# Altium schematic sheet 3_adcs_circuits.schdoc: Power Circuits
size A4; Engineer: Eng_2_ALT; SheetNumber: 3; SheetTotal: 3; Designed by: André M. P. Mattos; Version: v0.1
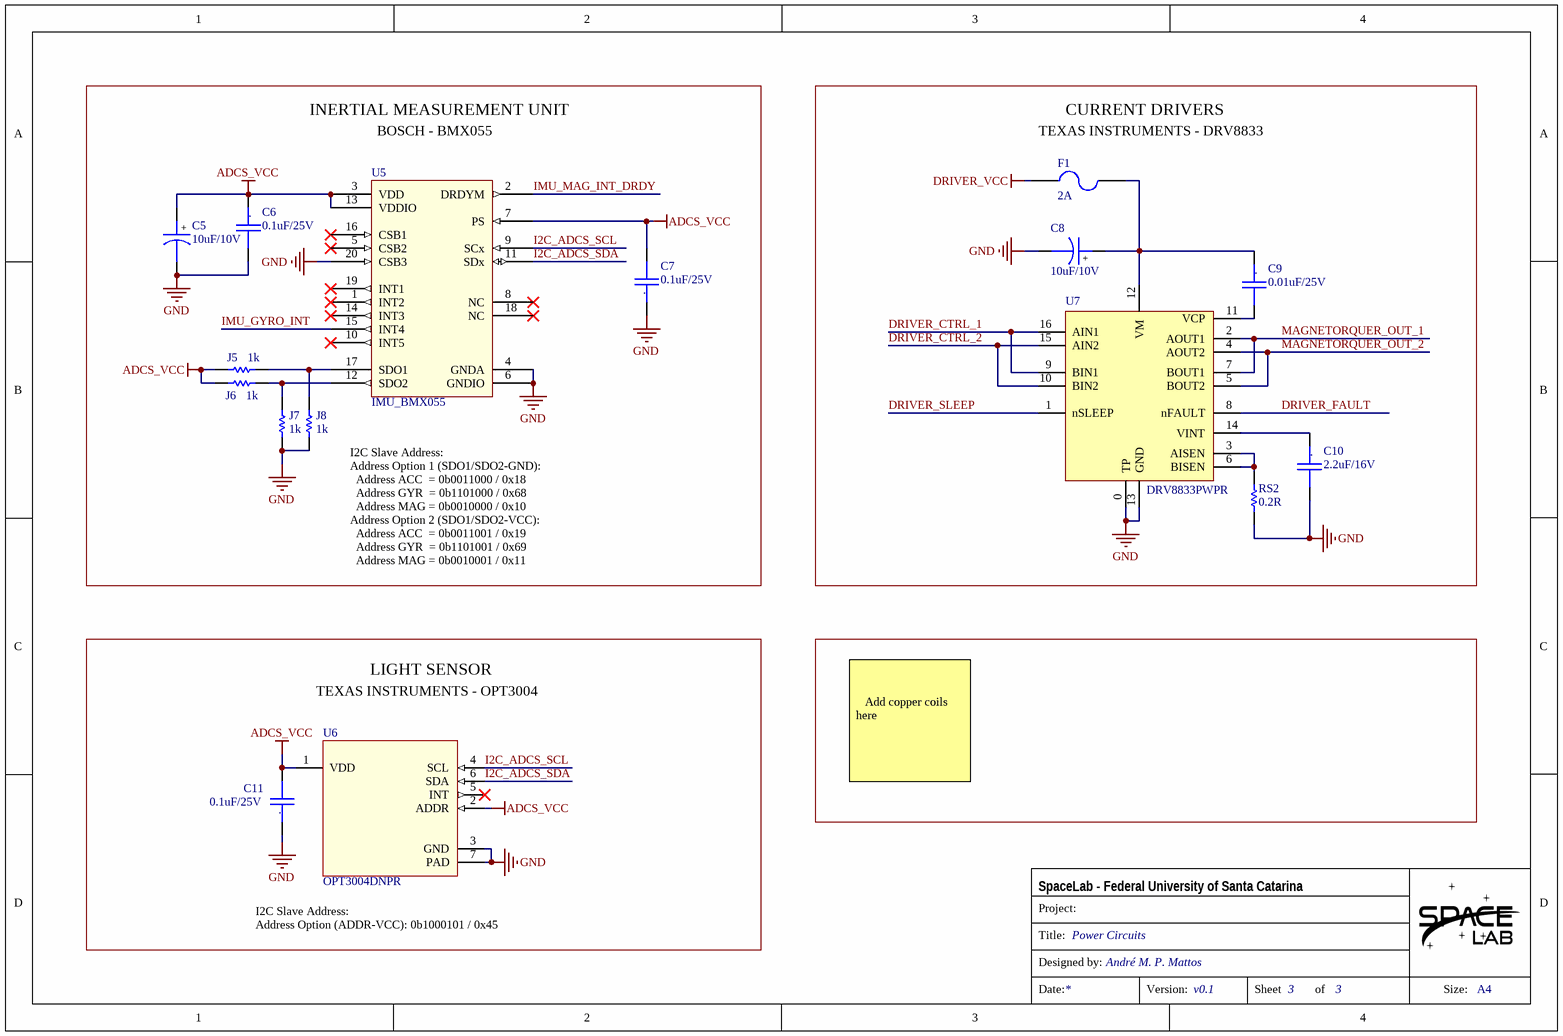
[diagram p0: 3_adcs_circuits.schdoc]

## Parts
C5  10uF/10V  [CC0805_Tantalum]
C6  0.1uF/25V  [CC0805]
C7  0.1uF/25V  [CC0805]
C8  10uF/10V  [CC0805_Tantalum]
C9  0.01uF/25V  [CC0805]
C10  2.2uF/16V  [CC0805]
C11  0.1uF/25V  [CC0805]
F1  2A  [1206]
J5  1k  [0805]
J6  1k  [0805]
J7  1k  [0805]
J8  1k  [0805]
RS2  0.2R  [0805]
U5  IMU_BMX055  [LGA20]
U6  OPT3004DNPR  [DNP0006A]
U7  DRV8833PWPR  [16TTSSOP]

## Blocks framed on the sheet
INERTIAL MEASUREMENT UNIT: C5-C7 J5-J8 U5
CURRENT DRIVERS: C8-C10 F1 RS2 U7
LIGHT SENSOR: C11 U6

## Nets
ADCS_VCC: C5.1 C6.1 C7.2 C11.2 J5.2 J6.2 U5.3(VDD) U5.7(PS) U5.13(VDDIO) U6.1(VDD) U6.2(ADDR)
DRIVER_VCC: F1.2
GND: C5.2 C6.2 C7.1 C8.2 C10.2 C11.1 J7.1 J8.1 RS2.1 U5.4(GNDA) U5.6(GNDIO) U5.20(CSB3) U6.3(GND) U6.7(PAD) U7.0(TP) U7.13(GND)
DRIVER_CTRL_1: U7.9(BIN1) U7.16(AIN1)
DRIVER_CTRL_2: U7.10(BIN2) U7.15(AIN2)
DRIVER_FAULT: U7.8(nFAULT)
DRIVER_SLEEP: U7.1(nSLEEP)
I2C_ADCS_SCL: U5.9(SCx) U6.4(SCL)
I2C_ADCS_SDA: U5.11(SDx) U6.6(SDA)
IMU_GYRO_INT: U5.15(INT4)
IMU_MAG_INT_DRDY: U5.2(DRDYM)
MAGNETORQUER_OUT_1: U7.2(AOUT1) U7.7(BOUT1)
MAGNETORQUER_OUT_2: U7.4(AOUT2) U7.5(BOUT2)
NetC8_1: C8.1 C9.1 F1.1 U7.12(VM)
NetC9_2: C9.2 U7.11(VCP)
NetC10_1: C10.1 U7.14(VINT)
NetJ5_1: J5.1 J8.2 U5.17(SDO1)
NetJ6_1: J6.1 J7.2 U5.12(SDO2)
NetRS2_2: RS2.2 U7.3(AISEN) U7.6(BISEN)

Not connected (* = marked no-connect by the designer): U5 1(INT2)* 5(CSB2)* 8(NC)* 10(INT5)* 14(INT3)* 16(CSB1)* 18(NC)* 19(INT1)*; U6 5(INT)*

## Notes on the sheet
- BOSCH - BMX055
- (near F1) TEXAS INSTRUMENTS - DRV8833
- I2C Slave Address:
  Address Option 1 (SDO1/SDO2-GND):
  Address ACC  = 0b0011000 / 0x18
  Address GYR  = 0b1101000 / 0x68
  Address MAG = 0b0010000 / 0x10
  Address Option 2 (SDO1/SDO2-VCC):
  Address ACC  = 0b0011001 / 0x19
  Address GYR  = 0b1101001 / 0x69
  Address MAG = 0b0010001 / 0x11
- TEXAS INSTRUMENTS - OPT3004
- Add copper coils here
- (near U6) I2C Slave Address:
  Address Option (ADDR-VCC): 0b1000101 / 0x45
- Project:
- SpaceLab - Federal University of Santa Catarina
- Title:
- Designed by:
- Date:
- Version:
- Sheet
- of
- Size:
- A4
- (in symbol Cap_Cer_X7R_0.1uF_25V_0805) .
- (in symbol Cap_Cer_X7R_0.01uF_50V_0805) .
- (in symbol Cap_Cer_X7R_2.2uF_16V_0805) .
- (in symbol Cap_Tant_SMD_10uF_10V_0805) +

## Library data of the parts
C5 C8 = Cap_Tant_SMD_10uF_10V_0805: CAP Tantalum 10uF 10V 20% 0805; Partnumber: TPSP106M010R2000; NCM: 8532.21.11
C6 C7 C11 = Cap_Cer_X7R_0.1uF_25V_0805: CAP CER 0.1UF 25V 10% X7R 0805; Partnumber: CC0805KRX7R8BB104; NCM: 8532.24.10
C9 = Cap_Cer_X7R_0.01uF_50V_0805: CAP CER 0.01uF 25V 10% X7R 0805; Partnumber: CL21B103KAANNNC; NCM: 8532.24.10
C10 = Cap_Cer_X7R_2.2uF_16V_0805: CAP CER 2.2uF 16V 10% X7R 0805; Partnumber: EMF212B7225KGHT
F1 = Fuse: Surface Mount Fuses SMD 1206 Fast Action 2A; PartNumber: SF-1206FP200-2
J5-J8 = R1.0k_1%_1/8W_0805: RES 1.0K OHM 1/8W 1% 0805; Partnumber: RC0805FR-071KL; NCM: 8533.21.20
RS2 = R0.2_1%_1/4W_0805: RES 0.2R OHM 1/4W 1% 0805; Partnumber: ERJ-U6SFR20V; NCM: 8533.21.20
U6 = OPT3004DNPR: No Description Available; Manufacturer: Texas Instruments; PartNumber: OPT3004DNPR; RefDes: RefDes; Type: DEV; Value: Value; Copyright: Copyright (C) 2018 Accelerated Designs. All rights reserved
U7 = DRV8833PWPR: Partnumber: DRV8833PWPR